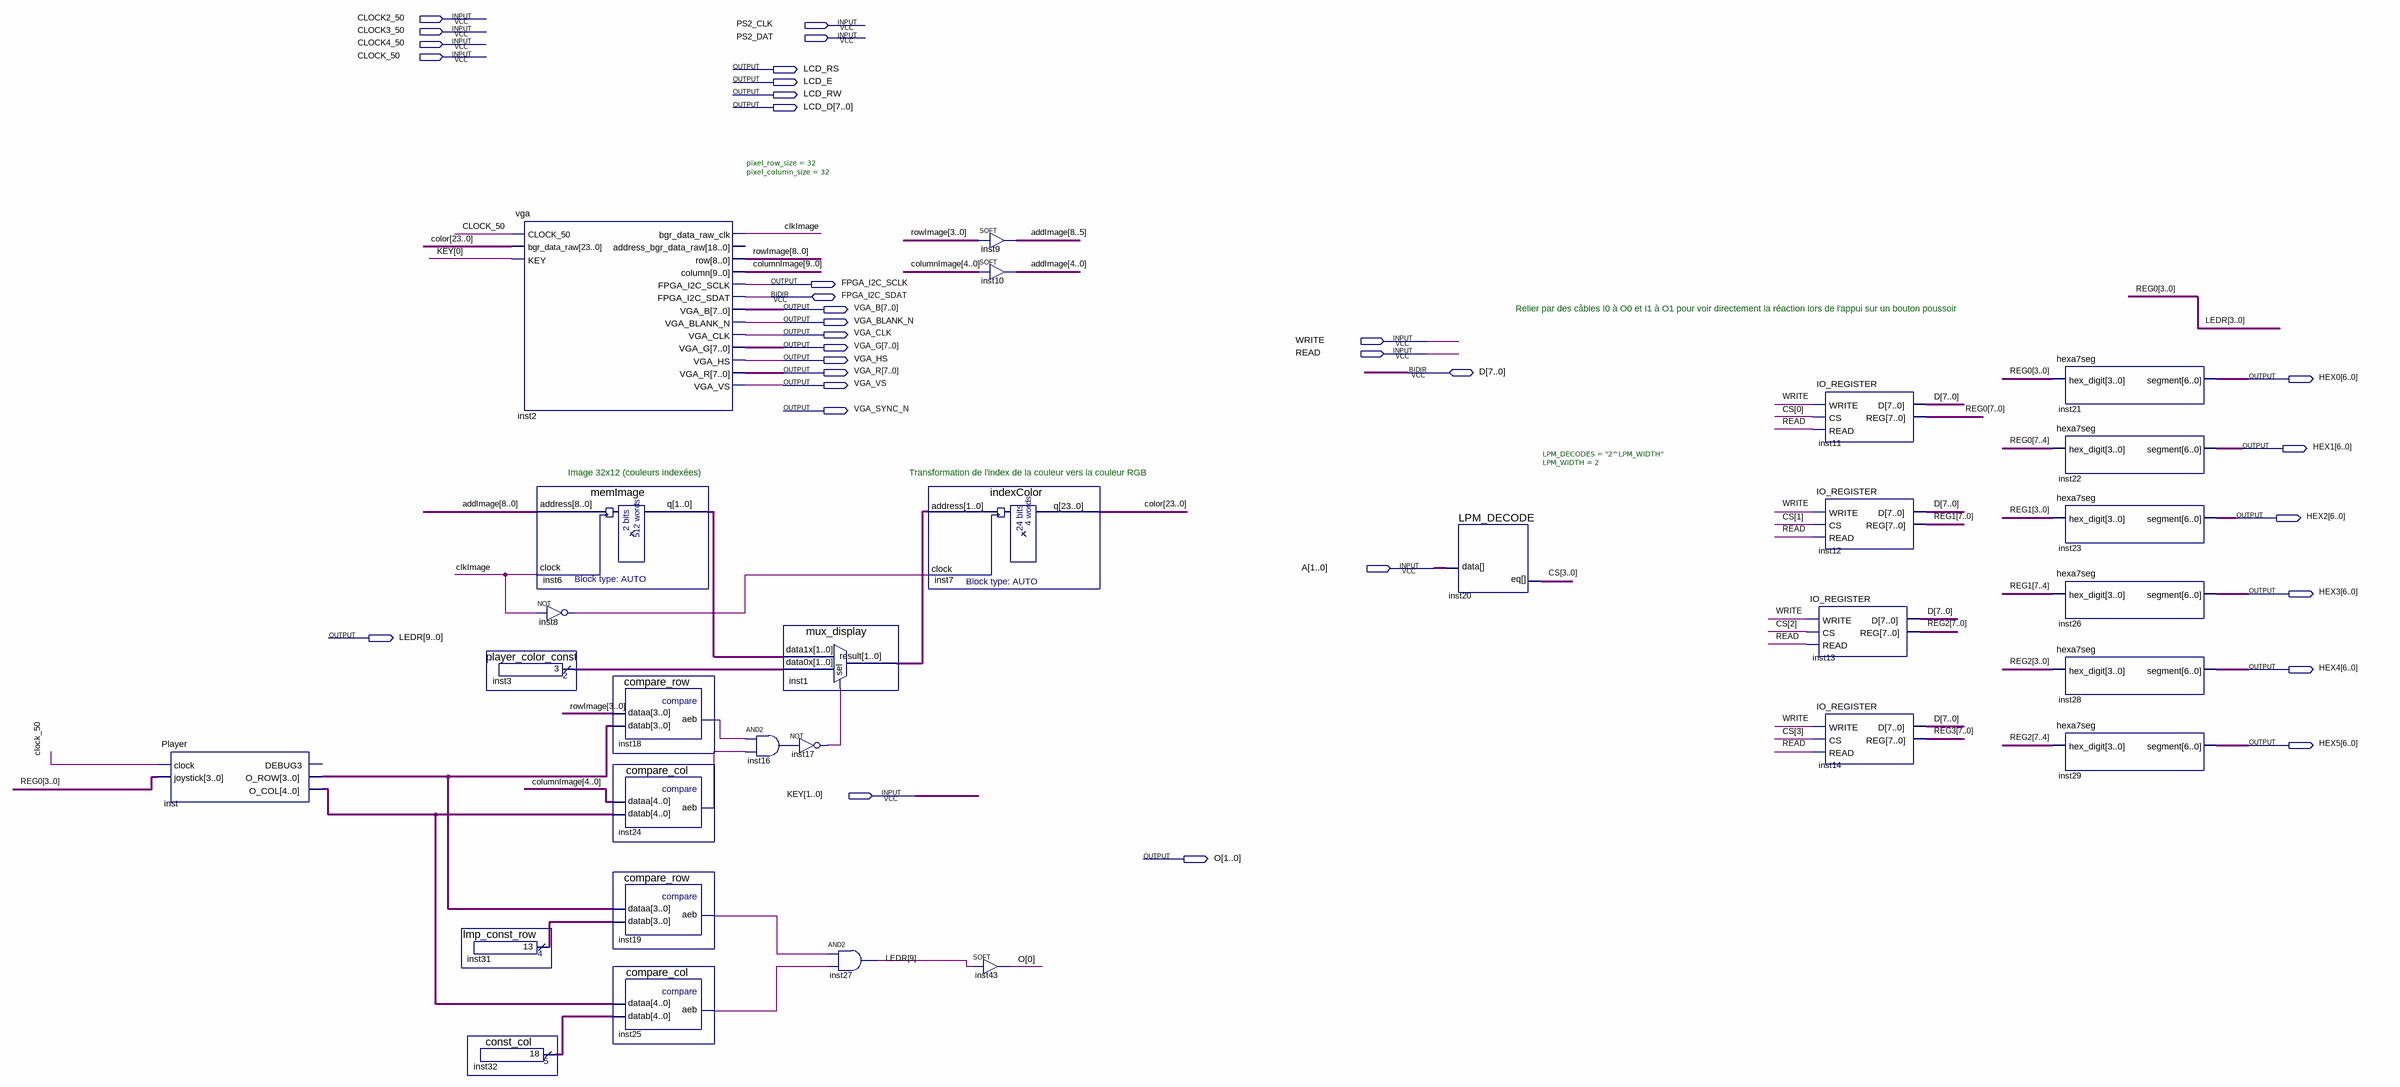
[diagram p0: schematic sheet]
// Quartus schematic Main.bdf as structural Verilog: 30 symbols, 33 pins
module Main (
  input  CLOCK2_50,
  input  PS2_CLK,
  input  CLOCK3_50,
  input  PS2_DAT,
  input  CLOCK4_50,
  input  CLOCK_50,
  input  WRITE,
  input  READ,
  input  [1:0] A,
  input  [1:0] KEY,
  inout  FPGA_I2C_SDAT,
  inout  [7:0] D,
  output LCD_RS,
  output LCD_E,
  output LCD_RW,
  output [7:0] LCD_D,
  output FPGA_I2C_SCLK,
  output [7:0] VGA_B,
  output VGA_BLANK_N,
  output VGA_CLK,
  output [7:0] VGA_G,
  output VGA_HS,
  output [7:0] VGA_R,
  output [6:0] HEX0,
  output VGA_VS,
  output VGA_SYNC_N,
  output [6:0] HEX1,
  output [6:0] HEX2,
  output [6:0] HEX3,
  output [9:0] LEDR,
  output [6:0] HEX4,
  output [6:0] HEX5,
  output [1:0] O
);

  wire clkImage, inst8_out, inst16_out, inst17_out, inst18_aeb, inst19_aeb, inst24_aeb, inst25_aeb;
  wire [1:0] inst1_result, inst3_result, inst6_q;
  wire [3:0] CS, inst31_result, inst_o_row;
  wire [4:0] inst32_result, inst_o_col;
  wire [7:0] REG0, REG1, REG2, REG3;
  wire [8:0] addImage, rowImage;
  wire [9:0] columnImage;
  wire [23:0] color;

  Player inst (.clock(CLOCK_50), .joystick(REG0[3:0]), .O_ROW(inst_o_row), .O_COL(inst_o_col));  // open: DEBUG3
  player_color_const inst3 (.result(inst3_result));
  lmp_const_row inst31 (.result(inst31_result));
  const_col inst32 (.result(inst32_result));
  vga #(.pixel_row_size(32), .pixel_column_size(32)) inst2 (
    .CLOCK_50(CLOCK_50), .bgr_data_raw(color), .KEY(KEY[0]), .bgr_data_raw_clk(clkImage), .row(rowImage),
    .column(columnImage), .FPGA_I2C_SCLK(FPGA_I2C_SCLK), .VGA_B(VGA_B), .VGA_BLANK_N(VGA_BLANK_N),
    .VGA_CLK(VGA_CLK), .VGA_G(VGA_G), .VGA_HS(VGA_HS), .VGA_R(VGA_R), .VGA_VS(VGA_VS),
    .FPGA_I2C_SDAT(FPGA_I2C_SDAT));  // open: address_bgr_data_raw
  memImage inst6 (.address(addImage), .clock(clkImage), .q(inst6_q));
  not inst8 (inst8_out, clkImage);
  compare_row inst18 (.dataa(rowImage[3:0]), .datab(inst_o_row), .aeb(inst18_aeb));
  compare_col inst24 (.dataa(columnImage[4:0]), .datab(inst_o_col), .aeb(inst24_aeb));
  compare_row inst19 (.dataa(inst_o_row), .datab(inst31_result), .aeb(inst19_aeb));
  compare_col inst25 (.dataa(inst_o_col), .datab(inst32_result), .aeb(inst25_aeb));
  and inst16 (inst16_out, inst18_aeb, inst24_aeb);
  mux_display inst1 (.data1x(inst6_q), .data0x(inst3_result), .sel(inst17_out), .result(inst1_result));
  not inst17 (inst17_out, inst16_out);
  and inst27 (LEDR[9], inst19_aeb, inst25_aeb);
  indexColor inst7 (.address(inst1_result), .clock(inst8_out), .q(color));
  SOFT inst9[3:0] (.IN(rowImage[3:0]), .OUT(addImage[8:5]));
  SOFT inst10[4:0] (.IN(columnImage[4:0]), .OUT(addImage[4:0]));
  SOFT inst43 (.IN(LEDR[9]), .OUT(O[0]));
  LPM_DECODE #(.LPM_DECODES("2^LPM_WIDTH"), .LPM_WIDTH(2)) inst20 (.data(A), .eq(CS));
  IO_REGISTER inst11 (.WRITE(WRITE), .CS(CS[0]), .READ(READ), .REG(REG0), .D(D));
  IO_REGISTER inst12 (.WRITE(WRITE), .CS(CS[1]), .READ(READ), .REG(REG1), .D(D));
  IO_REGISTER inst13 (.WRITE(WRITE), .CS(CS[2]), .READ(READ), .REG(REG2), .D(D));
  IO_REGISTER inst14 (.WRITE(WRITE), .CS(CS[3]), .READ(READ), .REG(REG3), .D(D));
  hexa7seg inst21 (.hex_digit(REG0[3:0]), .segment(HEX0));
  hexa7seg inst22 (.hex_digit(REG0[7:4]), .segment(HEX1));
  hexa7seg inst23 (.hex_digit(REG1[3:0]), .segment(HEX2));
  hexa7seg inst26 (.hex_digit(REG1[7:4]), .segment(HEX3));
  hexa7seg inst28 (.hex_digit(REG2[3:0]), .segment(HEX4));
  hexa7seg inst29 (.hex_digit(REG2[7:4]), .segment(HEX5));

  // Notes on the sheet:
  //   Relier par des câbles I0 à O0 et I1 à O1 pour voir directement la réaction lors de l'appui sur un bouton poussoir
  //   Image 32x12 (couleurs indexées)
  //   Transformation de l'index de la couleur vers la couleur RGB
endmodule
